# EasyEDA Pro project Hedgehog.epro

# Schematic Hedgehog
Board Name: Hedgehog; Create Date: 2026-05-08; Page Name: P1; Project Name: IO Board; Schematic Name: Hedgehog; Update Date: 2026-05-07; Company: XBST LLC; Drawn: Isik; Page Size: A4; Version: v1.0
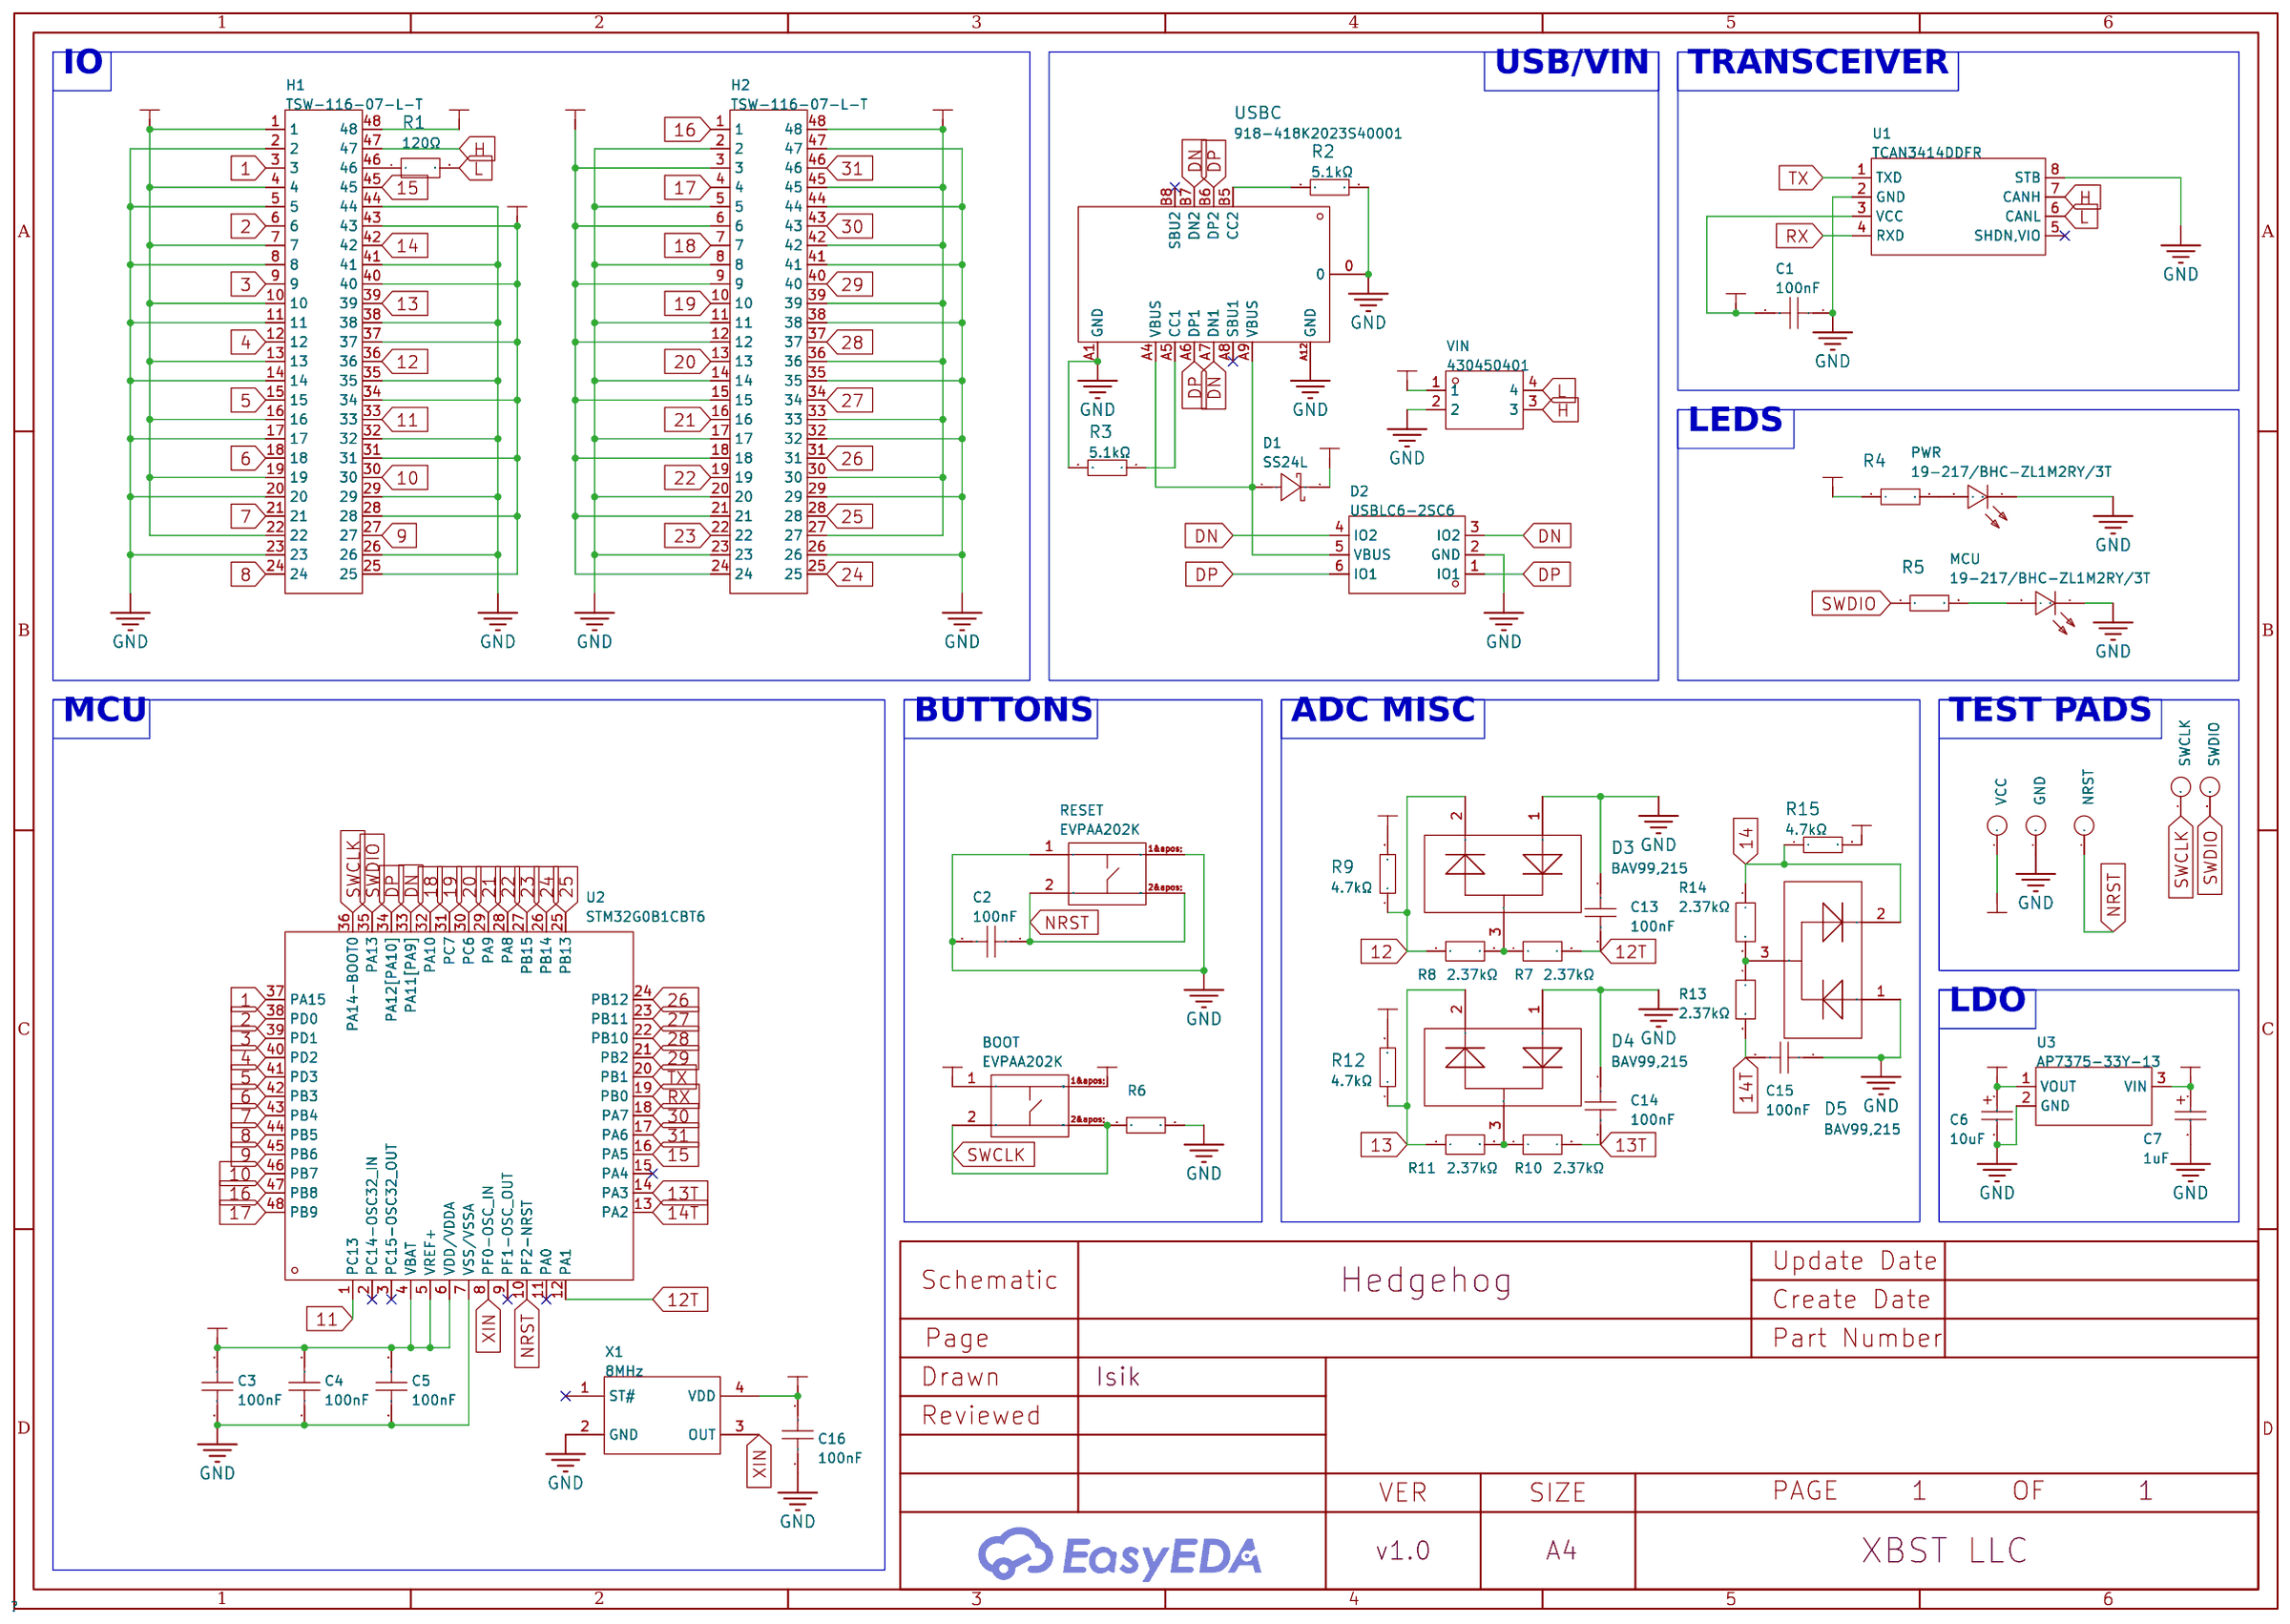
[diagram p0: schematic sheet]

## Parts
BOOT  EVPAA202K  [KEY-SMD_4P-L3.5-W2.9-P1.48-LS4.3-TL]
C1  100nF  [C0402]
C2  100nF  [C0402]
C3  100nF  [C0402]
C4  100nF  [C0402]
C5  100nF  [C0402]
C6  10uF  [CAP-SMD_L3.2-W1.6-RD]
C7  1uF  [CAP-SMD_L3.2-W1.6-RD]
C13  100nF  [C0402]
C14  100nF  [C0402]
C15  100nF  [C0402]
C16  100nF  [C0402]
D1  SS24L  [SOD-123FL_L2.8-W1.8-LS3.7-R-RD]
D2  USBLC6-2SC6  [SOT-23-6_L2.9-W1.6-P0.95-LS2.8-BL]
D3  BAV99,215  [SOT-23-3_L2.9-W1.6-P1.90-LS2.8-BR]
D4  BAV99,215  [SOT-23-3_L2.9-W1.6-P1.90-LS2.8-BR]
D5  BAV99,215  [SOT-23-3_L2.9-W1.6-P1.90-LS2.8-BR]
GND  NO  [TP]  (no BOM)
H1  TSW-116-07-L-T  [HDR-TH_48P-P2.54-V-M-R3-C16-S2.54_1]
H2  TSW-116-07-L-T  [HDR-TH_48P-P2.54-V-M-R3-C16-S2.54_1]
MCU  19-217/BHC-ZL1M2RY/3T  [LED0603-FD_BLUE]
NRST  NO  [TP]  (no BOM)
PWR  19-217/BHC-ZL1M2RY/3T  [LED0603-FD_BLUE]
R1  120Ω  [R0805]
R2  5.1kΩ  [R0402]
R3  5.1kΩ  [R0402]
R4  1.5kΩ  [R0402]
R5  1.5kΩ  [R0402]
R6  10kΩ  [R0402]
R7  2.37kΩ  [R0402]
R8  2.37kΩ  [R0402]
R9  4.7kΩ  [R0402]
R10  2.37kΩ  [R0402]
R11  2.37kΩ  [R0402]
R12  4.7kΩ  [R0402]
R13  2.37kΩ  [R0402]
R14  2.37kΩ  [R0402]
R15  4.7kΩ  [R0402]
RESET  EVPAA202K  [KEY-SMD_4P-L3.5-W2.9-P1.48-LS4.3-TL]
SWCLK  NO  [TP]  (no BOM)
SWDIO  NO  [TP]  (no BOM)
U1  TCAN3414DDFR  [TSOT-23-8_L2.9-W1.6-P0.65-LS2.8-BR]
U2  STM32G0B1CBT6  [LQFP-48_L7.0-W7.0-P0.50-LS9.0-BL]
U3  AP7375-33Y-13  [SOT-89-3_L4.5-W2.5-P1.50-LS4.0-BR]
USBC  918-418K2023S40001  [USB-C-SMD_TYPE-C-USB-17]
VCC  NO  [TP]  (no BOM)
VIN  430450401  [CONN-TH_0430450400]
X1  8MHz  [OSC-SMD_4P-L2.5-W2.0-BL]

## Library data of the parts
BOOT RESET = EVPAA202K: Circuit:SPST Actuator Style:Rectangle button Operating Force:1.6N Mounting Style:Brick nogging Switch Length:3.5mm Switch Width:2.9mm Switch Height:1.7mm Contact Current:20mA Voltage Rating (AC):- Voltage Rating (DC):15V Insulation Resistance:100MΩ With L; LCSC Part Name: 3.5*2.9*1.7mm 立贴 轻触开关; Supplier Part: C79147; Manufacturer: PANASONIC(松下); Supplier Footprint: SMD,2.9x3.5mm; JLCPCB Part Class: Extended Part; Datasheet: https://atta.szlcsc.com/upload/public/pdf/source/20160718/1468827513915.pdf; Supplier: LCSC; Circuit: SPST; Actuator Style: Rectangle button; Operating Force: 1.6N; Mounting Style: Brick nogging; Switch Length: 3.5mm; Switch Width: 2.9mm; Switch Height: 1.7mm; Contact Current: 20mA; Voltage Rating (DC): 15V; Insulation Resistance: 100MΩ; Pin Style: J pin; Mechanical Life: 20万次; Operating Temperature: -40℃~+85℃
C1-C5 C13-C15 = CL05B104KB54PNC: Capacitance: Tolerance:±10% Tolerance:±10% Voltage Rated: Temperature Coefficient:; LCSC Part Name: 100nF ±10% 50V; Supplier Part: C307331; Manufacturer: SAMSUNG(三星); Supplier Footprint: 0402; JLCPCB Part Class: Basic Part; Datasheet: https://atta.szlcsc.com/upload/public/pdf/source/20160218/1457707763339.pdf; Supplier: LCSC; Tolerance: ±10%
C6 = TAJA106K016RNJ: Capacitance:10uF Tolerance:±10% Tolerance:±10% Voltage Rating:16V Equivalent Series Resistance(ESR):3Ω@100kHz Operating Temperature:-55℃~+125℃ Operating Temperature:-55℃~+125℃; LCSC Part Name: 10uF ±10% 16V; Supplier Part: C7171; Manufacturer: Kyocera AVX; Supplier Footprint: CASE-A-3216-18(mm); Supplier: LCSC; Tolerance: ±10%; Voltage Rating: 16V; Equivalent Series Resistance(ESR): 3Ω@100kHz; Operating Temperature: -55℃~+125℃
C7 = TAJA106K016RNJ: Capacitance:10uF Tolerance:±10% Tolerance:±10% Voltage Rating:16V Equivalent Series Resistance(ESR):3Ω@100kHz Operating Temperature:-55℃~+125℃ Operating Temperature:-55℃~+125℃; LCSC Part Name: 10uF ±10% 16V; Supplier Part: C7176; Manufacturer: Kyocera AVX; Manufacturer Part: TAJA105K035RNJ; Supplier Footprint: CASE-A-3216-18(mm); Supplier: LCSC; Tolerance: ±10%; Voltage Rating: 16V; Equivalent Series Resistance(ESR): 3Ω@100kHz; Operating Temperature: -55℃~+125℃
C16 = CL05B104KB54PNC: Capacitance: Tolerance:±10% Tolerance:±10% Voltage Rated: Temperature Coefficient:; LCSC Part Name: 100nF ±10% 50V; Supplier Part: C307331; Manufacturer: SAMSUNG(三星); Supplier Footprint: 0402; Datasheet: https://atta.szlcsc.com/upload/public/pdf/source/20160218/1457707763339.pdf; Supplier: LCSC; Tolerance: ±10%
D1 = SS24L: Supplier: LCSC; Supplier Part: C2827931; Manufacturer: Hottech(合科泰); JLCPCB Part Class: Extended Part
D2 = USBLC6-2SC6_C2827654: polarity:Unidirectional Reverse Stand-Off Voltage (Vrwm):5V Maximum Clamping Voltage:12V Peak Pulse Current (Ipp):6A Peak Pulse Power Dissipation (Ppp):150W Breakdown Voltage:6V Reverse Leakage Current (Ir):80nA Number of Lines:Dual channel Operating Temp; LCSC Part Name: ESD，可防30kV静电; Supplier Part: C2827654; Manufacturer: TECH PUBLIC(台舟); Supplier Footprint: SOT-23-6; JLCPCB Part Class: Extended Part; Datasheet: https://atta.szlcsc.com/upload/public/pdf/source/20210810/FBD75DE717D6D97BAC6DD7F2B5C09DCD.pdf; Supplier: LCSC; polarity: Unidirectional; Reverse Stand-Off Voltage (Vrwm): 5V; Maximum Clamping Voltage: 12V; Peak Pulse Current (Ipp): 6A; Peak Pulse Power Dissipation (Ppp): 150W; Breakdown Voltage: 6V; Reverse Leakage Current (Ir): 80nA; Number of Lines: Dual channel; Operating Temperature: -55℃~+125℃; level of protection: IEC 61000-4-2; Type: ESD
D3-D5 = BAV99,215: Diode Configuration:1 Pair Series Connection Voltage - Forward(Vf@If):1.25V@150mA Voltage - DC Reverse(Vr):100V Current - Rectified:215mA Pd - Power Dissipation:250mW Reverse Leakage Current (Ir):500nA@80V Reverse Recovery Time (trr):4ns Operating Junctio; LCSC Part Name: 100V 215mA; Supplier Part: C2500; Manufacturer: Nexperia(安世); Supplier Footprint: SOT-23; Datasheet: https://item.szlcsc.com/datasheet/BAV99%252C215/2877.html; Supplier: LCSC; Diode Configuration: 1 Pair Series Connection; Voltage - Forward(Vf@If): 1.25V@150mA; Voltage - DC Reverse(Vr): 100V; Current - Rectified: 215mA; Pd - Power Dissipation: 250mW; Reverse Leakage Current (Ir): 500nA@80V; Reverse Recovery Time (trr): 4ns; Non-Repetitive Peak Forward Surge Current: 4A
GND NRST SWCLK SWDIO VCC = NO
H1 H2 = TSW-116-07-L-T: Pitch:2.54mm Row Spacing:2.54mm Mounting Type:Through Hole Number of Rows:3 Number of Pins:48P Contact Material:Phosphor Bronze Contact Plating:Tin Operating Temperature:-55℃~+125℃ Operating Temperature:-55℃~+125℃ Color:Black; LCSC Part Name: 间距:2.54mm 直插; Supplier Part: C6566891; Manufacturer: SAMTEC; Supplier Footprint: 插件,P=2.54mm; JLCPCB Part Class: Extended Part; Datasheet: https://item.szlcsc.com/datasheet/TSW-116-07-L-T/7521045.html; Supplier: LCSC; Pitch: 2.54mm; Row Spacing: 2.54mm; Mounting Type: Through Hole; Number of Rows: 3; Number of Pins: 48P; Contact Material: Phosphor Bronze; Contact Plating: Tin; Operating Temperature: -55℃~+125℃; Color: Black
MCU PWR = 19-217/BHC-ZL1M2RY/3T: Emitted Color:Blue Power Dissipation:110mW Forward Current:5mA Dominant Wavelength:465nm~475nm Dominant Wavelength:465nm~475nm Peak Wavelength:468nm Diode Configuration:- Lens Color:无色透明透镜 Color Temperature:- Color Temperature:- Viewing Angle:120° Mountin; LCSC Part Name: 蓝灯; Supplier Part: C72041; Manufacturer: EVERLIGHT(亿光); Supplier Footprint: 0603; JLCPCB Part Class: Extended Part; Datasheet: https://atta.szlcsc.com/upload/public/pdf/source/20170116/1484561237273.pdf; Supplier: LCSC; Emitted Color: Blue; Power Dissipation: 110mW; Forward Current: 5mA; Dominant Wavelength: 465nm~475nm; Peak Wavelength: 468nm; Lens Color: 无色透明透镜; Viewing Angle: 120°; Operating Temperature: -40℃~+85℃
R1 = ERJP06F1200V: Type:Thick Film Resistors Resistance: Tolerance:±1% Tolerance:±1% Power(Watts): Overload Voltage (Max):600V Temperature Coefficient:±100ppm/℃ Temperature Coefficient:±100ppm/℃ Operating Temperature Range:-55℃~+155℃ Operating Temperature Range:-55℃~+155℃; LCSC Part Name: 120Ω ±1% 500mW 厚膜电阻; Supplier Part: C543533; Manufacturer: PANASONIC(松下); Supplier Footprint: 0805; JLCPCB Part Class: Extended Part; Datasheet: https://atta.szlcsc.com/upload/public/pdf/source/20200515/C543414_D3FB4A44C151AC19BA141503575FC797.pdf; Supplier: LCSC; Type: Thick Film Resistors; Tolerance: ±1%; Overload Voltage (Max): 600V; Temperature Coefficient: ±100ppm/℃; Operating Temperature Range: -55℃~+155℃
R2 R3 = 0402WGF5101TCE: Type:Thick Film Resistors Resistance:5.1kΩ Tolerance:±1% Tolerance:±1% Power(Watts): Overload Voltage (Max): Temperature Coefficient:±100ppm/℃ Temperature Coefficient:±100ppm/℃ Operating Temperature Range:-55℃~+155℃ Operating Temperature Range:-55℃~+155℃; LCSC Part Name: 5.1kΩ ±1% 62.5mW 厚膜电阻; Supplier Part: C25905; Manufacturer: UNI-ROYAL(厚声); Supplier Footprint: 0402; JLCPCB Part Class: Basic Part; Datasheet: https://atta.szlcsc.com/upload/public/pdf/source/20200306/C422600_1E6D84923E4A46A82E41ADD87F860B5C.pdf; Supplier: LCSC; Type: Thick Film Resistors; Tolerance: ±1%; Temperature Coefficient: ±100ppm/℃; Operating Temperature Range: -55℃~+155℃
R4 R5 = 0402WGF1501TCE: Type:Thick Film Resistors Resistance:1.5kΩ Tolerance:±1% Tolerance:±1% Power(Watts): Overload Voltage (Max): Temperature Coefficient:±100ppm/℃ Temperature Coefficient:±100ppm/℃ Operating Temperature Range:-55℃~+155℃ Operating Temperature Range:-55℃~+155℃; LCSC Part Name: 1.5kΩ ±1% 62.5mW 厚膜电阻; Supplier Part: C25867; Manufacturer: UNI-ROYAL(厚声); Supplier Footprint: 0402; JLCPCB Part Class: Basic Part; Datasheet: https://atta.szlcsc.com/upload/public/pdf/source/20200306/C422600_1E6D84923E4A46A82E41ADD87F860B5C.pdf; Supplier: LCSC; Type: Thick Film Resistors; Tolerance: ±1%; Temperature Coefficient: ±100ppm/℃; Operating Temperature Range: -55℃~+155℃
R6 = 0402WGF1002TCE: Type:Thick Film Resistors Resistance:10kΩ Tolerance:±1% Tolerance:±1% Power(Watts): Overload Voltage (Max): Temperature Coefficient:±100ppm/℃ Temperature Coefficient:±100ppm/℃ Operating Temperature Range:-55℃~+155℃ Operating Temperature Range:-55℃~+155℃; LCSC Part Name: 10kΩ ±1% 62.5mW 厚膜电阻; Supplier Part: C25744; Manufacturer: UNI-ROYAL(厚声); Supplier Footprint: 0402; JLCPCB Part Class: Basic Part; Datasheet: https://atta.szlcsc.com/upload/public/pdf/source/20200306/C422600_1E6D84923E4A46A82E41ADD87F860B5C.pdf; Supplier: LCSC; Type: Thick Film Resistors; Tolerance: ±1%; Temperature Coefficient: ±100ppm/℃; Operating Temperature Range: -55℃~+155℃
R7 R8 R10 R11 R13 R14 = RC0402FR-072K37L_C294439: Type:Thick Film Resistor Resistance:2.37kΩ Tolerance:±1% Tolerance:±1% Power(Watts):62.5mW Voltage-Supply(Max):50V Temperature Coefficient:±100ppm/℃ Temperature Coefficient:±100ppm/℃ Operating Temperature:-55℃~+155℃ Operating Temperature:-55℃~+155℃; LCSC Part Name: 厚膜电阻 2.37kΩ ±1% 62.5mW; Supplier Part: C294439; Manufacturer: YAGEO(国巨); Manufacturer Part: RC0402FR-072K37L; Supplier Footprint: 0402; Datasheet: https://item.szlcsc.com/datasheet/RC0402FR-072K37L/279596.html; Supplier: LCSC; Type: Thick Film Resistor; Tolerance: ±1%; Power(Watts): 62.5mW; Voltage-Supply(Max): 50V; Temperature Coefficient: ±100ppm/℃; Operating Temperature: -55℃~+155℃
R9 R12 R15 = 0402WGF4701TCE: Type:Thick Film Resistor Resistance:4.7kΩ Tolerance:±1% Tolerance:±1% Power(Watts):62.5mW Voltage-Supply(Max):50V Temperature Coefficient:±100ppm/℃ Temperature Coefficient:±100ppm/℃ Operating Temperature:-55℃~+155℃ Operating Temperature:-55℃~+155℃; LCSC Part Name: 4.7kΩ ±1% 62.5mW 厚膜电阻; Supplier Part: C25900; Manufacturer: UNI-ROYAL(厚声); Supplier Footprint: 0402; Datasheet: https://item.szlcsc.com/datasheet/0402WGF4701TCE/26643.html; Supplier: LCSC; Type: Thick Film Resistor; Tolerance: ±1%; Power(Watts): 62.5mW; Voltage-Supply(Max): 50V; Temperature Coefficient: ±100ppm/℃; Operating Temperature: -55℃~+155℃
U1 = TCAN3414DDFR: Type:CAN FD Transceiver Data Rate:8Mbps Voltage - Supply:3.3V Voltage - Supply:3.3V Current - Supply:55mA Operating Temperature:-40℃~+150℃ Operating Temperature:-40℃~+150℃ Number of Channels:1 Quiescent Supply Current:17uA; LCSC Part Name: 3.3V CAN FD收发器，支持待机模式和±58V总线关断; Supplier Part: C24836183; Manufacturer: TI(德州仪器); Supplier Footprint: TSOT-23-8; JLCPCB Part Class: Extended Part; Datasheet: https://www.ti.com.cn/cn/lit/ds/symlink/tcan3414.pdf?ts=1738808603330&ref_url=https%253A%252F%252Fwww.ti.com.cn%252Fsitesearch%252Fzh-cn%252Fdocs%252Funiversalsearch.tsp%253FlangPref%253Dzh-CN%2526nr%253D9%2526searchTerm%253DTCAN3414DDFR; Supplier: LCSC; Type: CAN FD Transceiver; Data Rate: 8Mbps; Voltage - Supply: 3.3V; Current - Supply: 55mA; Operating Temperature: -40℃~+150℃; Number of Channels: 1; Quiescent Supply Current: 17uA
U2 = STM32G0B1CBT6: CPU Core:ARM-MSeries GPIO Ports Number:- Operating Voltage Range:- Operating Voltage Range:- CPU Maximum Speed:- Program Memory Type:- ADC (Bit):- DAC (Bit):- PWM (Bit):- Universal Serial Bus:- Internal Comparator:- communication protocol:- Watchdog:- Rea; Supplier Part: C2847904; Manufacturer: ST(意法半导体); Supplier Footprint: LQFP-48(7x7); JLCPCB Part Class: Extended Part; Datasheet: https://atta.szlcsc.com/upload/public/pdf/source/20210707/C2829307_30DFBC3FA791244241E64BDE5F705BBC.pdf; Supplier: LCSC; CPU Core: ARM-MSeries
U3 = AP7375-33Y-13: Output Type:Fixed Voltage - Supply:45V Output Voltage:3.3V Output Voltage:3.3V Output Current:300mA Power Supply Rejection Ratio (PSRR):85dB@(1kHz) Voltage Dropout:35mV@(10mA)；350mV@(100mA) standby current:2.1uA Features:Short Circuit Protection；Over Temp; LCSC Part Name: 宽输入电压范围300mA低压差稳压器; Supplier Part: C20644901; Manufacturer: DIODES(美台); Supplier Footprint: SOT-89; Datasheet: https://item.szlcsc.com/datasheet/AP7375-33Y-13/22059365.html; Supplier: LCSC; Output Type: Fixed; Voltage - Supply: 45V; Output Voltage: 3.3V; Output Current: 300mA; Power Supply Rejection Ratio (PSRR): 85dB@(1kHz); Voltage Dropout: 35mV@(10mA)；350mV@(100mA); standby current: 2.1uA; Features: Short Circuit Protection；Over Temperature Protection; Operating Temperature: -40℃~+125℃@(Tj); Output Configuration: Positive; Number of Outputs: 1
USBC = 918-418K2023S40001: Connector Type:Type-C Standard:- Gender:Female Number of Ports:1 Number of Contacts:16P Current Rating - Power (Max):3A; LCSC Part Name: Type-C 母; Supplier Part: C167321; Manufacturer: 精拓金; Supplier Footprint: SMD; JLCPCB Part Class: Extended Part; Datasheet: https://atta.szlcsc.com/upload/public/pdf/source/20210305/C167321_3BB79E85CEB6874BF587E64926D16F83.pdf; Supplier: LCSC; Connector Type: Type-C; Gender: Female; Number of Ports: 1; Number of Contacts: 16P; Current Rating - Power (Max): 3A
VIN = 430450401: Pins Structure:2x2P Pitch:3mm Mounting Type:Right-Angle Reference Series:Micro-Fit(MX 3.0) Number of Pins:4P Number of Rows:2 Number of PINs Per Row:2 Row Spacing:3mm Current Rating:8.5A Contact Material:Brass Contact Plating:Gold Operating Temperature:-4; LCSC Part Name: 2x2P 间距:3mm 弯插 系列:Micro-Fit(MX 3.0); Supplier Part: C585880; Manufacturer: MOLEX; Supplier Footprint: 弯插,P=3mm; Datasheet: https://www.molex.com/content/dam/molex/molex-dot-com/products/automated/en-us/salesdrawingpdf/430/43045/430450401_sd.pdf?inline; Supplier: LCSC; Pins Structure: 2x2P; Pitch: 3mm; Mounting Type: Right-Angle; Reference Series: Micro-Fit(MX 3.0); Number of Pins: 4P; Number of Rows: 2; Number of PINs Per Row: 2; Row Spacing: 3mm; Current Rating: 8.5A; Contact Material: Brass; Contact Plating: Gold; Operating Temperature: -40℃~+105℃; Voltage Rating: 600V; Flame Retardant Rating: UL94V-0; Supplementary Features: Fishhook Foot (Plastic); Color: Black; Z-Height of the Board: 8.77mm; X-Length of Bottom Edge on Board (Spacing Line): 9.65mm; Y-Width of Bottom Edge on Board: 12.24mm
X1 = X1G0041710033: Frequency:25MHz Output Type:- Supply Voltage:1.6V~3.6V Supply Voltage:1.6V~3.6V Supply Current (Max):3mA Frequency Stability(Full temperature range):- Frequency Stability(Full temperature range):- Operating Temperature:-40℃~+85℃ Operating Temperature:-40℃; LCSC Part Name: X1G004171003300; Supplier Part: C70560; Manufacturer: EPSON; Manufacturer Part: SG-210STF 8.0000ML0; Supplier Footprint: SMD2520-4P; JLCPCB Part Class: Extended Part; Datasheet: https://atta.szlcsc.com/upload/public/pdf/source/20161110/1478747520507.pdf; Supplier: LCSC; Supply Voltage: 1.6V~3.6V; Supply Current (Max): 3mA; Operating Temperature: -40℃~+85℃

## Nets
3V3: BOOT.1 BOOT.1&apos; C1.2 C3.1 C4.2 C5.2 C6.1 C16.2 H1.1 H1.4 H1.7 H1.10 H1.13 H1.16 H1.19 H1.22 H1.25 H1.28 H1.31 H1.34 H1.37 H1.40 H1.43 H2.3 H2.6 H2.9 H2.12 H2.15 H2.18 H2.21 H2.24 H2.27 H2.30 H2.33 H2.36 H2.39 H2.42 H2.45 H2.48 R4.1 R9.2 R12.2 R15.2 U1.3(VCC) U2.4(VBAT) U2.5(VREF+) U2.6(VDD/VDDA) U3.1(VOUT) VCC.1 X1.4(VDD)
GND: C1.1 C2.2 C3.2 C4.1 C5.1 C6.2 C7.2 C13.1 C14.1 C15.1 C16.1 D2.2(GND) D3.1 D4.1 D5.1 GND.1 H1.2 H1.5 H1.8 H1.11 H1.14 H1.17 H1.20 H1.23 H1.26 H1.29 H1.32 H1.35 H1.38 H1.41 H1.44 H2.2 H2.5 H2.8 H2.11 H2.14 H2.17 H2.20 H2.23 H2.26 H2.29 H2.32 H2.35 H2.38 H2.41 H2.44 H2.47 MCU.1(C) PWR.1(C) R2.1 R3.2 R6.2 RESET.1 RESET.1&apos; U1.2(GND) U1.8(STB) U2.7(VSS/VSSA) U3.2(GND) USBC.0 USBC.A1(GND) USBC.A12(GND) VIN.2 X1.2(GND)
VIN: C7.1 D1.2(K) H1.48 U3.3(VIN) VIN.1
1: H1.3 U2.37(PA15)
2: H1.6 U2.38(PD0)
3: H1.9 U2.39(PD1)
4: H1.12 U2.40(PD2)
5: H1.15 U2.41(PD3)
6: H1.18 U2.42(PB3)
7: H1.21 U2.43(PB4)
8: H1.24 U2.44(PB5)
9: H1.27 U2.45(PB6)
10: H1.30 U2.46(PB7)
11: H1.33 U2.1(PC13)
12: D3.2 H1.36 R8.1 R9.1
12T: C13.2 R7.2 U2.12(PA1)
13: D4.2 H1.39 R11.1 R12.1
13T: C14.2 R10.2 U2.14(PA3)
14: D5.2 H1.42 R14.1 R15.1
14T: C15.2 R13.2 U2.13(PA2)
15: H1.45 U2.16(PA5)
16: H2.1 U2.47(PB8)
17: H2.4 U2.48(PB9)
18: H2.7 U2.32(PA10)
19: H2.10 U2.31(PC7)
20: H2.13 U2.30(PC6)
21: H2.16 U2.29(PA9)
22: H2.19 U2.28(PA8)
23: H2.22 U2.27(PB15)
24: H2.25 U2.26(PB14)
25: H2.28 U2.25(PB13)
26: H2.31 U2.24(PB12)
27: H2.34 U2.23(PB11)
28: H2.37 U2.22(PB10)
29: H2.40 U2.21(PB2)
30: H2.43 U2.18(PA7)
31: H2.46 U2.17(PA6)
DN: D2.3(IO2) D2.4(IO2) U2.33(PA11[PA9]) USBC.A7(DN1) USBC.B7(DN2)
DP: D2.1(IO1) D2.6(IO1) U2.34(PA12[PA10]) USBC.A6(DP1) USBC.B6(DP2)
H: H1.47 U1.7(CANH) VIN.3
L: R1.2 U1.6(CANL) VIN.4
NRST: C2.1 NRST.1 RESET.2 RESET.2&apos; U2.10(PF2-NRST)
RX: U1.4(RXD) U2.19(PB0)
SWCLK: BOOT.2 BOOT.2&apos; R6.1 SWCLK.1 U2.36(PA14-BOOT0)
SWDIO: R5.1 SWDIO.1 U2.35(PA13)
TX: U1.1(TXD) U2.20(PB1)
XIN: U2.8(PF0-OSC_IN) X1.3(OUT)
$1N5628: H1.46 R1.1
$1N7742: R3.1 USBC.A5(CC1)
$1N7743: D1.1(A) D2.5(VBUS) USBC.A4(VBUS) USBC.A9(VBUS)
$1N7746: R2.2 USBC.B5(CC2)
$1N8474: PWR.2(A) R4.2
$1N8475: MCU.2(A) R5.2
$1N9446: D3.3 R7.1 R8.2
$1N9910: D4.3 R10.1 R11.2
$1N10162: D5.3 R13.1 R14.2

Not connected (* = marked no-connect by the designer): U1 5(SHDN,VIO)*; U2 2(PC14-OSC32_IN)* 3(PC15-OSC32_OUT)* 9(PF1-OSC_OUT)* 11(PA0)* 15(PA4)*; USBC A8(SBU1)* B8(SBU2)*; X1 1(ST#)*

## Notes on the sheet
- IO
- USB/VIN
- TRANSCEIVER
- LEDS
- MCU
- BUTTONS
- ADC MISC
- TEST PADS
- LDO

# Board PCB1_4
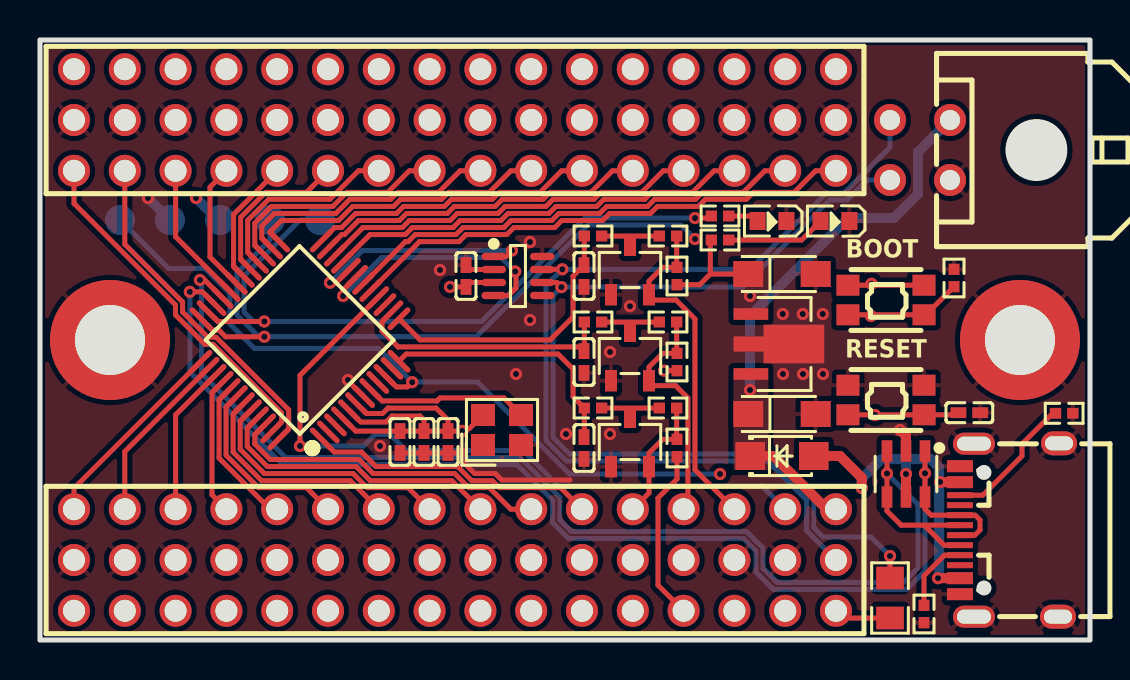
[diagram p1: board, top side]
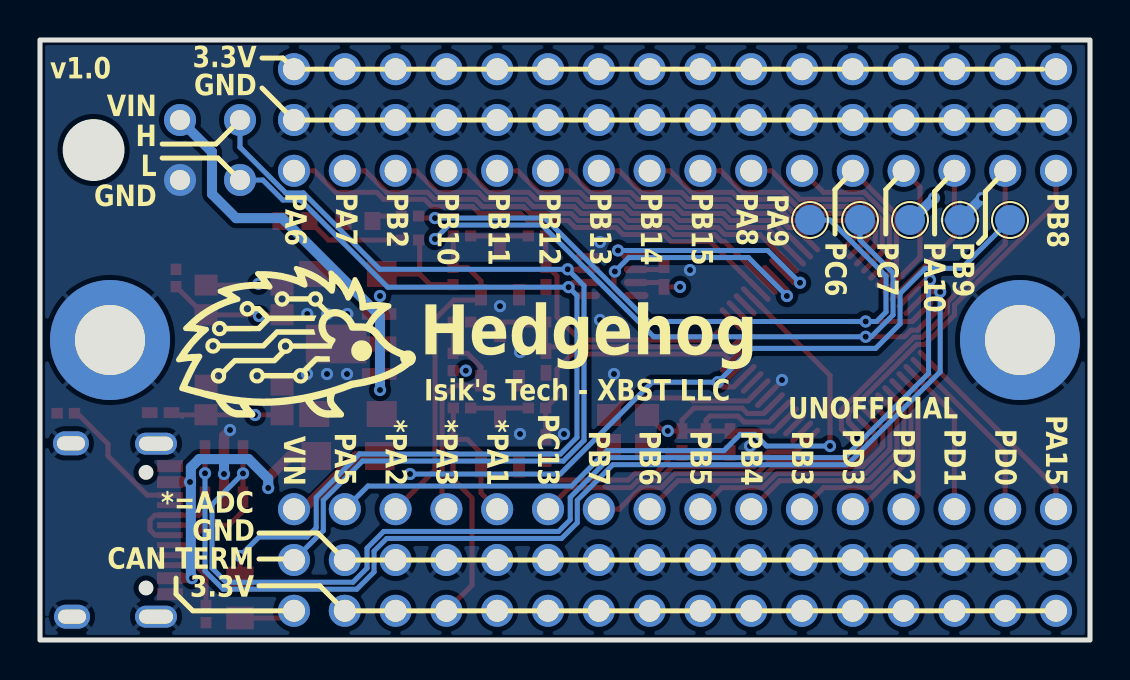
[diagram p2: board, bottom side, seen from below]

Outline 52.5 x 30 mm; copper layers: Top Layer, Inner1, Inner2, Bottom Layer. Coordinates in mm from the lower left corner of the outline.
Outline path: rectangle 0,30 52.5,0
Stack: Top Layer 0.035mm Outer layer thickness 1oz / Dielectric1 0.2104mm 7628 RC49% 8.6mil / Inner1 0.0152mm Inner layer thickness / Dielectric2 1.065mm 1.1mm H/HOZ Copper / Inner2 0.0152mm Inner layer thickness / Dielectric3 0.2104mm 7628 RC49% 8.6mil / Bottom Layer 0.035mm Outer layer thickness 1oz

## Design rules (mm)
template: Custom Config
spacing copperThickness1oz (default): track to track 0.102, other pairs 0.152 to 0.3
spacing copperThickness2oz: track to track 0.203, other pairs 0.152 to 0.3
track width copperThickness1oz (default): min 0.127, default 0.254, max 2.54
track width copperThickness2oz: min 0.203, default 0.254, max 2.54
differential pair differentialPair (default): width min 0.127, default 0.254, max 2.54; gap min 0.152, default 0.152
via viaSize (default): diameter min 0.5, default 0.61, max 10; hole min 0.3, default 0.305, max 6.3
pour e918 uses copperRegion1
pour e924 uses copperRegion1
pour e932 uses copperRegion1
pour e2180 uses copperRegion1
pour e5972 uses copperRegion1

## Placement (name value [footprint] x y rotation side)
BOOT  EVPAA202K  [KEY-SMD_4P-L3.5-W2.9-P1.48-LS4.3-TL]  42.3 17 0 top
C1  100nF  [C0402]  21.3 18.2 270 top
C2  100nF  [C0402]  46.47 11.37 0 top
C3  100nF  [C0402]  18 9.9 270 top
C4  100nF  [C0402]  19.2 9.9 90 top
C5  100nF  [C0402]  20.4 9.9 90 top
C6  10uF  [CAP-SMD_L3.2-W1.6-RD]  37.1 18.3 0 top
C7  1uF  [CAP-SMD_L3.2-W1.6-RD]  37.1 11.3 0 top
C13  100nF  [C0402]  27.2 9.6 90 top
C14  100nF  [C0402]  27.2 13.9 90 top
C15  100nF  [C0402]  27.2 18.2 90 top
D1  SS24L  [SOD-123FL_L2.8-W1.8-LS3.7-R-RD]  37.1 9.2 0 top
D2  USBLC6-2SC6  [SOT-23-6_L2.9-W1.6-P0.95-LS2.8-BL]  43.3 8.3 180 top
D3  BAV99,215  [SOT-23-3_L2.9-W1.6-P1.90-LS2.8-BR]  29.5 9.9 270 top
D4  BAV99,215  [SOT-23-3_L2.9-W1.6-P1.90-LS2.8-BR]  29.5 14.2 270 top
D5  BAV99,215  [SOT-23-3_L2.9-W1.6-P1.90-LS2.8-BR]  29.5 18.5 270 top
GND  NO  [TP]  6.5 21 180 bottom
H1  TSW-116-07-L-T  [HDR-TH_48P-P2.54-V-M-R3-C16-S2.54_1]  20.75 4 0 top
H2  TSW-116-07-L-T  [HDR-TH_48P-P2.54-V-M-R3-C16-S2.54_1]  20.75 26 0 top
MCU  19-217/BHC-ZL1M2RY/3T  [LED0603-FD_BLUE]  36.6 20.95 180 top
NOREF  -  [Pad_e17]  49 15 180 top
NOREF#2  -  [Pad_e15]  3.5 15 0 top
NRST  NO  [TP]  4 21 180 bottom
PWR  19-217/BHC-ZL1M2RY/3T  [LED0603-FD_BLUE]  39.75 20.95 180 top
R1  120Ω  [R0805]  42.5 2.1 90 top
R2  5.1kΩ  [R0402]  51.21 11.34 180 top
R3  5.1kΩ  [R0402]  44.2 1.3 270 top
R4  1.5kΩ  [R0402]  34 20 0 top
R5  1.5kΩ  [R0402]  34 21.2 0 top
R6  10kΩ  [R0402]  45.7 18.1 90 top
R7  2.37kΩ  [R0402]  27.65 11.6 180 top
R8  2.37kΩ  [R0402]  31.4 11.6 180 top
R9  4.7kΩ  [R0402]  31.85 9.6 270 top
R10  2.37kΩ  [R0402]  27.65 15.9 180 top
R11  2.37kΩ  [R0402]  31.4 15.9 180 top
R12  4.7kΩ  [R0402]  31.85 13.9 270 top
R13  2.37kΩ  [R0402]  27.65 20.2 180 top
R14  2.37kΩ  [R0402]  31.4 20.2 180 top
R15  4.7kΩ  [R0402]  31.85 18.2 270 top
RESET  EVPAA202K  [KEY-SMD_4P-L3.5-W2.9-P1.48-LS4.3-TL]  42.3 12 0 top
SWCLK  NO  [TP]  11.5 21 180 bottom
SWDIO  NO  [TP]  14 21 180 bottom
U1  TCAN3414DDFR  [TSOT-23-8_L2.9-W1.6-P0.65-LS2.8-BR]  23.9 18.2 180 top
U2  STM32G0B1CBT6  [LQFP-48_L7.0-W7.0-P0.50-LS9.0-BL]  13 15 45 top
U3  AP7375-33Y-13  [SOT-89-3_L4.5-W2.5-P1.50-LS4.0-BR]  36.9 14.8 180 top
USBC  918-418K2023S40001  [USB-C-SMD_TYPE-C-USB-17]  48.5 5.5 90 top
VCC  NO  [TP]  9 21 270 bottom
VIN  430450401  [CONN-TH_0430450400]  44 24.5 90 top
X1  8MHz  [OSC-SMD_4P-L2.5-W2.0-BL]  23.1 10.5 0 top

## Footprints (pads in the part's own frame, mm; a bottom-side part is the same pattern mirrored in y, then rotated)
C0402
  rect 0.79x0.54 smd: 1(-0.545,0) 2(0.545,0)
CAP-SMD_L3.2-W1.6-RD
  rect 1.5x1.296 smd: 1(-1.687,0) 2(1.687,0)
CONN-TH_0430450400
  round 1.6 hole 1: 1(1.5,-1.5) 2(-1.5,-1.5) 3(1.5,1.5) 4(-1.5,1.5)
HDR-TH_48P-P2.54-V-M-R3-C16-S2.54_1
  round 1.6 hole 1.1: 1(-19.05,-2.54) 2(-19.05,0) 3(-19.05,2.54) 4(-16.51,-2.54) 5(-16.51,0) 6(-16.51,2.54) 7(-13.97,-2.54) 8(-13.97,0) 9(-13.97,2.54) 10(-11.43,-2.54) 11(-11.43,0) 12(-11.43,2.54) 13(-8.89,-2.54) 14(-8.89,0) 15(-8.89,2.54) 16(-6.35,-2.54) 17(-6.35,0) 18(-6.35,2.54) 19(-3.81,-2.54) 20(-3.81,0) 21(-3.81,2.54) 22(-1.27,-2.54) 23(-1.27,0) 24(-1.27,2.54) 25(1.27,-2.54) 26(1.27,0) 27(1.27,2.54) 28(3.81,-2.54) 29(3.81,0) 30(3.81,2.54) 31(6.35,-2.54) 32(6.35,0) 33(6.35,2.54) 34(8.89,-2.54) 35(8.89,0) 36(8.89,2.54) 37(11.43,-2.54) 38(11.43,0) 39(11.43,2.54) 40(13.97,-2.54) 41(13.97,0) 42(13.97,2.54) 43(16.51,-2.54) 44(16.51,0) 45(16.51,2.54) 46(19.05,-2.54) 47(19.05,0) 48(19.05,2.54)
KEY-SMD_4P-L3.5-W2.9-P1.48-LS4.3-TL
  rect 1.15x1.05 smd: 1(-1.902,0.74) 1(1.899,0.74) 2(-1.902,-0.74) 2(1.902,-0.74)
LED0603-FD_BLUE
  rect 0.8x0.9 smd: 1(-0.72,0) 2(0.72,0)
LQFP-48_L7.0-W7.0-P0.50-LS9.0-BL
  oval 0.27x1.5 smd: 1(-2.75,-4.25) 2(-2.25,-4.25) 3(-1.75,-4.25) 4(-1.25,-4.25) 5(-0.75,-4.25) 6(-0.25,-4.25) 7(0.25,-4.25) 8(0.75,-4.25) 9(1.25,-4.25) 10(1.75,-4.25) 11(2.25,-4.25) 12(2.75,-4.25) 25(2.75,4.25) 26(2.25,4.25) 27(1.75,4.25) 28(1.25,4.25) 29(0.75,4.25) 30(0.25,4.25) 31(-0.25,4.25) 32(-0.75,4.25) 33(-1.25,4.25) 34(-1.75,4.25) 35(-2.25,4.25) 36(-2.75,4.25)
  oval 1.5x0.27 smd: 13(4.25,-2.75) 14(4.25,-2.25) 15(4.25,-1.75) 16(4.25,-1.25) 17(4.25,-0.75) 18(4.25,-0.25) 19(4.25,0.25) 20(4.25,0.75) 21(4.25,1.25) 22(4.25,1.75) 23(4.25,2.25) 24(4.25,2.75) 37(-4.25,2.75) 38(-4.25,2.25) 39(-4.25,1.75) 40(-4.25,1.25) 41(-4.25,0.75) 42(-4.25,0.25) 43(-4.25,-0.25) 44(-4.25,-0.75) 45(-4.25,-1.25) 46(-4.25,-1.75) 47(-4.25,-2.25) 48(-4.25,-2.75)
OSC-SMD_4P-L2.5-W2.0-BL
  rect 1.2x1.1 smd: 1(-0.95,-0.75) 2(0.95,-0.75) 3(0.95,0.75) 4(-0.95,0.75)
Pad_e15
  round 6 hole 3.5: 1(0,0)
Pad_e17
  round 6 hole 3.5: 1(0,0)
R0402
  rect 0.566x0.54 smd: 1(-0.433,0) 2(0.433,0)
R0805
  rect 1.133x1.377 smd: 1(-1,0) 2(1,0)
SOD-123FL_L2.8-W1.8-LS3.7-R-RD
  rect 1.48x1.4 smd: 1(1.59,0) 2(-1.59,0)
SOT-23-3_L2.9-W1.6-P1.90-LS2.8-BR
  rect 1.07x0.6 smd: 1(1.235,-0.95) 2(1.235,0.95) 3(-1.235,0)
SOT-23-6_L2.9-W1.6-P0.95-LS2.8-BL
  rect 0.532x1.072 smd: 1(-0.95,-1.149) 2(0,-1.149) 3(0.95,-1.149) 4(0.95,1.149) 5(0,1.149) 6(-0.95,1.149)
SOT-89-3_L4.5-W2.5-P1.50-LS4.0-BR
  rect 1.73x0.58 smd: 1(1.356,-1.5) 3(1.356,1.5)
  rect 3.03x1.933 smd: 2(-0.794,0)
  rect 1.73x0.76 smd: 2(1.356,0)
TP
  round 1.5 smd: 1(0,0)
TSOT-23-8_L2.9-W1.6-P0.65-LS2.8-BR
  oval 1.222x0.364 smd: 1(1.211,-0.975) 2(1.211,-0.325) 3(1.211,0.325) 4(1.211,0.975) 5(-1.211,0.975) 6(-1.211,0.325) 7(-1.211,-0.325) 8(-1.211,-0.975)
USB-C-SMD_TYPE-C-USB-17
  oval 1.1x2.1 hole 0.7x1.7: 0(-4.334,1.802) 0(4.316,1.802)
  oval 1.2x1.8 hole 0.7x1.4: 0(-4.334,-2.398) 0(4.334,-2.453)
  rect 0.6x1.3 smd: A1(-3.209,2.502) A4(-2.409,2.502) A9(2.391,2.502) A12(3.191,2.502)
  rect 0.3x1.3 smd: A5(-1.259,2.502) A6(-0.259,2.502) A7(0.241,2.502) A8(1.24,2.503) B5(1.741,2.502) B6(0.741,2.502) B7(-0.759,2.502) B8(-1.759,2.503)

## Nets
As in the schematic, except:
3V3: BOOT.1 C1.2 C3.1 C4.2 C5.2 C6.1 H1.1 H1.4 H1.7 H1.10 H1.13 H1.16 H1.19 H1.22 H1.25 H1.28 H1.31 H1.34 H1.37 H1.40 H1.43 H2.3 H2.6 H2.9 H2.12 H2.15 H2.18 H2.21 H2.24 H2.27 H2.30 H2.33 H2.36 H2.39 H2.42 H2.45 H2.48 R4.1 R9.2 R12.2 R15.2 U1.3 U2.4 U2.5 U2.6 U3.1 VCC.1 X1.4
GND: C1.1 C2.2 C3.2 C4.1 C5.1 C6.2 C7.2 C13.1 C14.1 C15.1 D2.2 D3.1 D4.1 D5.1 GND.1 H1.2 H1.5 H1.8 H1.11 H1.14 H1.17 H1.20 H1.23 H1.26 H1.29 H1.32 H1.35 H1.38 H1.41 H1.44 H2.2 H2.5 H2.8 H2.11 H2.14 H2.17 H2.20 H2.23 H2.26 H2.29 H2.32 H2.35 H2.38 H2.41 H2.44 H2.47 MCU.1 NOREF.1 NOREF#2.1 PWR.1 R2.1 R3.2 R6.2 RESET.1 U1.2 U1.8 U2.7 U3.2 USBC.0 USBC.A1 USBC.A12 VIN.2 X1.2
NRST: C2.1 NRST.1 RESET.2 U2.10
SWCLK: BOOT.2 R6.1 SWCLK.1 U2.36

Pads without a net: U1 5; U2 2 3 9 11 15; USBC A8 B8; X1 1

## Via types
v1: diameter 0.61, hole 0.305, Top Layer to Bottom Layer, 49 vias

## Routing (per net, layer and track width the routed paths; a pad name or vN(x,y) marks a point on that pad's centre or on a via; arc(x,y) is an arc through that point)
3V3: length 40.6
  Top Layer w0.25: BOOT.1 BOOT.1 ; 31.85,9.17 31.85,8.05 30.9,7.1 30.9,2.74 H1.37 ; R4.1 33.52,19.95 33.52,18.3 ; 20.4,10.44 21.1,10.44 v1(21.11,10.46) 21.31,10.46 21.44,10.58 21.48,10.58 X1.4 ; 20.4,10.44 20.4,11 19.8,11.6 17.4,11.6 17.12,11.32 16.32,11.32 U2.6 ; 20.4,10.44 19.2,10.44 ; 15.12,11.11 15.79,10.44 19.2,10.44 ; R15.2 32.99,17.77 33.52,18.3 ; v1(20.5,17.66) C1.2 21.52,17.88 U1.3 ; 15.47,11.46 16.04,10.9 17.3,10.9 17.6,11.2 19,11.2 19.2,11 19.2,10.44 ; 33.52,18.3 C6.1 ; R12.2 31.2,13.47
  Bottom Layer w0.5: VCC.1 8.9,21 v1(7.8,22.1)
  vias: v1(31.21,13.47) v1(35.5,17.2) v1(41.58,17.81)
GND: length 14.9
  Top Layer w0.25: v1(15.4,13) 15.4,12.95 U2.7 ; U1.2 21.52,18.53 C1.1 ; C3.2 C4.1 C5.1 20.97,9.36 21.11,9.49 21.11,8.94 21.73,8.32 22.76,8.32 23.08,8 26.5,8
  Top Layer w0.5: D2.2 43.3,10.2 v1(43,10.5)
  Bottom Layer w0.5: GND.1 v1(5.4,22.1)
  vias: v1(17,9.7) v1(20,18.5) v1(23.8,13.3) v1(24.5,19.9) v1(24.5,16) v1(26.3,10.3) v1(28.5,14.4) v1(28.5,10.3) v1(29.5,16.69) v1(37.14,16.3) v1(37.15,13.3) v1(38.14,16.3) v1(38.15,13.3) v1(39.14,16.3) v1(39.15,13.3)
VIN: length 24.4
  Top Layer w0.5: D1.2 36.68,9.2 39.34,6.54 H1.48
  Bottom Layer w0.5: v1(35.5,12.5) 35.5,16.2 40.39,21.09 42.69,21.09 43.9,22.3 43.9,24.4 VIN.1
1: length 10
  Top Layer w0.25: H1.3 1.7,7.59 U2.37
2: length 8.8
  Top Layer w0.25: U2.38 4.24,9.42 H1.6
3: length 7.5
  Top Layer w0.25: H1.9 6.78,11.25 U2.39
4: length 6.8
  Top Layer w0.25: U2.40 8.6,12.37 8.6,7.26 H1.12
5: length 7.6
  Top Layer w0.25: 9.46,12.53 8.95,12.01 8.95,9.09 11.51,6.54 H1.15
6: length 9.4
  Top Layer w0.25: H1.18 13.32,7.62 10.93,7.62 9.3,9.24 9.3,11.66 U2.42
7: length 11.1
  Top Layer w0.25: H1.21 15.51,7.97 11.07,7.97 9.66,9.39 9.66,11.3 U2.43
8: length 12.9
  Top Layer w0.25: H1.24 18.4,7.62 16.36,7.62 15.66,8.32 11.22,8.32 10.01,9.53 10.01,10.95 10.53,11.46
9: length 14.6
  Top Layer w0.25: H1.27 20.59,7.97 16.51,7.97 15.8,8.67 11.37,8.67 10.36,9.68 10.36,10.59 10.88,11.11
10: length 16.3
  Top Layer w0.25: U2.46 10.74,10.26 10.74,9.8 11.51,9.03 15.95,9.03 16.65,8.32 20.74,8.32 21.44,7.62 22.47,7.62 23.54,6.54 H1.30
11: length 14.5
  Top Layer w0.25: U2.1 14.71,9.4 16.07,9.4 16.8,8.67 20.88,8.67 21.59,7.97 22.61,7.97 22.96,7.62 26.02,7.62 H1.33
12: length 6.4
  Top Layer w0.25: R8.1 31.83,10.05 R9.1 31.13,10.03 30.45,9.35 D3.2 30.45,7.35 H1.36
12T: length 12.8
  Top Layer w0.25: C13.2 27.22,10.16 27.22,11.6 26.65,12.16 26.65,13.55 25.9,14.3 18.31,14.3 U2.12
13: length 11.9
  Top Layer w0.25: R11.1 31.83,14.35 31.85,14.33 31.13,14.33 30.45,13.65 D4.2 30.7,12.72 31.78,12.72 32.4,12.1 32.4,6.76 H1.39
13T: length 13.2
  Top Layer w0.25: 27.22,14.46 27.2,14.44 ; 27.22,14.46 27.22,15.9 ; 27.22,14.46 27.03,14.65 17.91,14.65 17.1,15.45 17.1,15.92 U2.14
14: length 17.1
  Top Layer w0.25: H1.42 32.75,8.51 32.75,16.05 31.8,17 30.72,17 D5.2 30.45,17.95 31.13,18.63 31.85,18.63 31.83,18.65 R14.1
14T: length 13.9
  Top Layer w0.25: U2.13 19.01,15 25.5,15 26.65,16.15 26.65,18.2 C15.2 27.22,18.76 27.22,20.2
15: length 35.1
  Top Layer w0.25: 16.89,17.12 13,13.23 v1(13,9.7)
  Bottom Layer w0.25: v1(13,9.7) 16.18,9.7 16.76,10.28 17.49,10.28 18.3,9.47 24.15,9.47 25.92,7.7 36.1,7.7 H1.45
16: length 17.8
  Top Layer w0.25: H2.1 1.7,21.83 6.78,16.75 6.78,16.25 8.24,14.79 8.66,14.79 12.08,11.36 12.08,10.9 U2.47
17: length 17.2
  Top Layer w0.25: U2.48 12.43,10.54 12.43,11.51 8.8,15.14 8.39,15.14 7.13,16.4 7.13,16.9 4.24,19.79 H2.4
18: length 7.1
  Top Layer w0.25: 9.46,17.47 6.78,20.16 H2.7
19: length 6.5
  Top Layer w0.25: U2.31 8.5,19.15 8.5,22.64 H2.10
20: length 6.4
  Top Layer w0.25: U2.30 9.68,18.67 9.68,21.28 H2.13
21: length 8.1
  Top Layer w0.25: H2.16 13.32,22.38 11.28,22.38 10.03,21.13 10.03,19.03 10.53,18.54
22: length 9.9
  Top Layer w0.25: 10.88,18.89 10.39,19.38 10.39,20.99 11.43,22.03 14.49,22.03 15.92,23.46 H2.19
23: length 11.6
  Top Layer w0.25: U2.27 10.74,19.74 10.74,20.85 11.57,21.68 14.64,21.68 15.34,22.38 17.39,22.38 18.46,23.46 H2.22
24: length 13.4
  Top Layer w0.25: U2.26 11.09,20.09 11.09,20.7 11.72,21.33 14.79,21.33 15.49,22.03 17.53,22.03 17.88,22.38 19.93,22.38 21,23.46 H2.25
25: length 15
  Top Layer w0.25: H2.28 23.54,23.46 22.47,22.38 20.42,22.38 20.07,22.03 18.03,22.03 17.68,21.68 15.64,21.68 14.93,20.97 12.07,20.97 11.5,20.4 11.5,20.39 U2.25
26: length 14.5
  Top Layer w0.25: H2.31 26.08,23.46 25.01,22.38 22.96,22.38 22.61,22.03 20.57,22.03 20.22,21.68 18.18,21.68 17.82,21.33 15.78,21.33 15.08,20.62 14.73,20.62 U2.24
27: length 16.8
  Top Layer w0.25: H2.34 28.62,23.46 27.55,22.38 25.5,22.38 25.15,22.03 23.11,22.03 22.76,21.68 20.72,21.68 20.36,21.33 18.32,21.33 17.97,20.97 15.93,20.97 15.22,20.27 15.09,20.27 U2.23
28: length 19.2
  Top Layer w0.25: U2.22 16.15,20.62 18.12,20.62 18.47,20.97 20.51,20.97 20.86,21.33 22.9,21.33 23.26,21.68 25.3,21.68 25.65,22.03 27.69,22.03 28.04,22.38 30.09,22.38 31.16,23.46 H2.37
29: length 21.5
  Top Layer w0.25: 15.12,18.89 16.5,20.27 18.26,20.27 18.61,20.62 20.66,20.62 21.01,20.97 23.05,20.97 23.4,21.33 25.44,21.33 25.8,21.68 27.84,21.68 28.19,22.03 30.23,22.03 30.58,22.38 32.63,22.38 33.7,23.46 H2.40
30: length 23.4
  Top Layer w0.25: H2.43 36.24,23.46 35.17,22.38 33.12,22.38 32.77,22.03 30.73,22.03 30.38,21.68 28.34,21.68 27.98,21.33 25.94,21.33 25.59,20.97 23.55,20.97 23.19,20.62 21.15,20.62 20.8,20.27 18.76,20.27 18.41,19.92 18.27,19.92 U2.18
31: length 25.7
  Top Layer w0.25: 16.54,17.47 18.98,19.92 20.95,19.92 21.3,20.27 23.34,20.27 23.69,20.62 25.74,20.62 26.09,20.97 28.13,20.97 28.48,21.33 30.52,21.33 30.88,21.68 32.92,21.68 33.27,22.03 35.31,22.03 35.66,22.38 37.71,22.38 38.78,23.46 H2.46
DN: length 62.4
  Top Layer w0.25: U2.33 8.23,18 v1(8,18) ; USBC.A7 44.21,5.74 ; 44.21,5.74 45.21,4.74 USBC.B7 ; 44.21,5.74 43.06,5.74 42.35,6.45 D2.4 v1(42.35,8.33) D2.3
  Bottom Layer w0.25: v1(42.35,8.33) 43.9,6.78 43.9,3.6 43.19,2.89 36.85,2.89 36.15,3.59 36.15,4.59 35.31,5.43 26.57,5.43 25.99,6.01 25.99,7.13 24,9.12 12.28,9.12 8.07,13.32 8.07,17.93 v1(8,18)
DP: length 60.8
  Top Layer w0.25: D2.1 v1(44.25,8.34) D2.6 44.25,6.55 44.56,6.24 USBC.B6 46.76,6.24 47,6 47,5.5 46.74,5.24 USBC.A6 ; U2.34 8.12,17.41 v1(7.49,17.41)
  Bottom Layer w0.25: v1(7.49,17.41) 7.49,13.41 12.13,8.77 23.86,8.77 25.64,6.99 25.64,5.86 26.42,5.08 35.17,5.08 35.8,4.45 35.8,3.4 36.66,2.54 43.34,2.54 44.25,3.45 v1(44.25,8.34)
H: length 48
  Top Layer w0.25: v1(26.12,18.54) 25.54,18.54 25.53,18.53 U1.7
  Bottom Layer w0.25: VIN.3 42.5,24.64 40.22,22.35 39.33,22.35 35.51,18.54 v1(26.12,18.54) 25.3,17.72 25.3,9.98 26.33,8.95 36.38,8.95 38.34,6.99 38.34,5.46 H1.47
L: length 48.7
  Top Layer w0.25: v1(26.07,17.64) 25.84,17.88 U1.6 ; R1.2 v1(42.5,4.2)
  Bottom Layer w0.25: VIN.4 41.36,23 40.36,22 39.48,22 35.12,17.64 v1(26.07,17.64) 25.65,17.22 25.65,10.12 26.48,9.3 36.52,9.3 38.69,7.13 38.69,5.61 39.15,5.15 41.55,5.15 v1(42.5,4.2)
NRST: length 52.4
  Top Layer w0.25: RESET.2 RESET.2 45.82,11.26 45.92,11.37 ; v1(18.61,12.89) 18.37,12.66 17.82,12.66 U2.10
  Inner1 w0.25: v1(34,8.3) 38.8,8.3 v1(41.75,11.25)
  Bottom Layer w0.25: NRST.1 6.42,18.58 8.24,18.58 9.5,17.33 9.5,15.8 10.72,14.58 16.92,14.58 v1(18.61,12.89) 21.89,12.89 26.48,8.3 v1(34,8.3)
RX: length 13.1
  Top Layer w0.25: U2.19 15.16,17.51 v1(15.16,17.2) ; 22.69,17.22 23.43,17.22 23.8,17.6 23.8,18.38 v1(23.76,18.42)
  Bottom Layer w0.25: v1(15.16,17.2) 17.08,19.12 23.06,19.12 v1(23.76,18.42)
SWCLK: length 51.2
  Top Layer w0.25: U2.36 8.62,15.49 8.95,15.49 9.28,15.16 v1(11.22,15.16) ; 45.7,17.67 44.29,16.26 BOOT.2
  Inner1 w0.25: v1(32.75,20.05) 37.7,20.05 v1(41.55,16.2)
  Bottom Layer w0.25: v1(32.75,20.05) 32.05,20.75 27.4,20.75 21.81,15.16 v1(11.22,15.16) 10.94,15.16 9.85,16.25 9.85,18.35 11.5,20 SWCLK.1
SWDIO: length 35.5
  Top Layer w0.25: v1(32.75,21.1) 33.46,21.1 R5.1 ; U2.35 8.9,15.92 9.36,15.92 9.37,15.93 v1(11.22,15.93)
  Bottom Layer w0.25: v1(32.75,21.1) 27.25,21.1 22.08,15.93 v1(11.22,15.93) 10.67,15.93 10.2,16.4 10.2,18.2 13,21 SWDIO.1
TX: length 12.1
  Top Layer w0.25: 15.47,18.54 14.8,17.86 v1(14.5,17.86) ; v1(23.6,19.47) 23.3,19.17 U1.1
  Bottom Layer w0.25: v1(23.6,19.47) 16.11,19.47 v1(14.5,17.86)
XIN: length 8.2
  Top Layer w0.25: 16.54,12.53 17.11,11.95 19.85,11.95 20.01,12.11 23.19,12.11 X1.3
$1N5628: length 2.8
  Top Layer w0.25: R1.1 40.16,1.1 H1.46
$1N7742: length 3.7
  Top Layer w0.25: R3.1 44.2,3.21 45.23,4.24 USBC.A5
$1N7743: length 17.8
  Top Layer w0.5: D2.5 v1(43.3,8.3) ; USBC.A9 45.01,7.89 v1(45,7.9) ; USBC.A4 v1(44.9,3.09) ; D1.1 40,9.2 41.09,8.11 v1(41.09,7.6)
  Bottom Layer w0.5: 43.33,9.04 42.07,9.04 41.09,8.06 v1(41.09,7.6) ; 43.33,9.04 43.3,9.01 v1(43.3,8.3) ; 43.33,9.04 44.54,9.04 44.96,8.63 44.96,3.15 v1(44.9,3.09)
$1N7746: length 6.8
  Top Layer w0.25: R2.2 50.64,11.34 49.1,9.8 49.1,9.2 47.14,7.24 USBC.B5
$1N8474: length 5
  Top Layer w0.25: PWR.2 38.08,20 R4.2
$1N8475: length 1.6
  Top Layer w0.25: MCU.2 35.63,21.2 R5.2
$1N9446: length 2.9
  Top Layer w0.25: R8.2 R7.1
$1N9910: length 2.9
  Top Layer w0.25: R11.2 R10.1
$1N10162: length 2.9
  Top Layer w0.25: R14.2 R13.1

## Copper pours and planes (outline as drawn; the poured copper is in the pictures)
3V3 on Top Layer: 34.67,16 34.67,18.95 36.42,18.95 36.42,16
3V3 on Inner1: -3.5,32 53.8,32 54,31.8 54,-0.8 52.8,-2 -4.6,-2 -4.8,-2.2 -4.8,30.7
GND on Top Layer: -1.8,32.3 54.9,32.3 56.9,30.3 56.9,-3.8 57.2,-4.1 -2.6,-4.1 -2.7,-4.2 -2.7,31.4
GND on Top Layer: 34.2,16.5 39.61,16.5 39.61,12.77 34.2,12.77
GND on Bottom Layer: -3.9,37.1 56.9,37.1 62.2,31.8 62.2,-14.7 56.4,-20.5 -5.4,-20.5 -17.2,-8.7 -3.9,4.6
GND on Bottom Layer: 44.12,24.5 46.72,24.5 46.92,24.3 46.92,21.32 46.5,20.9 44.74,20.9 44.12,21.52
GND on Inner2: -2.3,32.8 53.4,32.8 54.2,32 54.2,-2.4 54,-2.6 -0.3,-2.6 -0.4,-2.7 -2.3,-0.8
GND on Inner2: 44,24.5 46.6,24.5 46.8,24.3 46.8,21.32 46.38,20.9 44.62,20.9 44,21.52
VIN on Top Layer: 36.42,13.6 36.42,8.5 34.67,8.5 34.67,13.6

## Text on the board
Bottom Silkscreen Layer: UNOFFICIAL | Isik's Tech - XBST LLC | v1.0 | Hedgehog | PB8 | PB9 | PA10 | PC7 | PC6 | PA9 | PA8 | PB15 | PB14 | PB13 | PB12 | PB11 | PB10 | PB2 | PA7 | PA6 | PA15 | PD0 | PD1 | PD2 | PD3 | PB3 | PB4 | PB5 | PB6 | PB7 | PC13 | *PA1 | *PA3 | *PA2 | PA5 | VIN | 3.3V | GND | *=ADC | CAN TERM | H | L
